# Altium schematic sheet Light Board.SchDoc
size A4
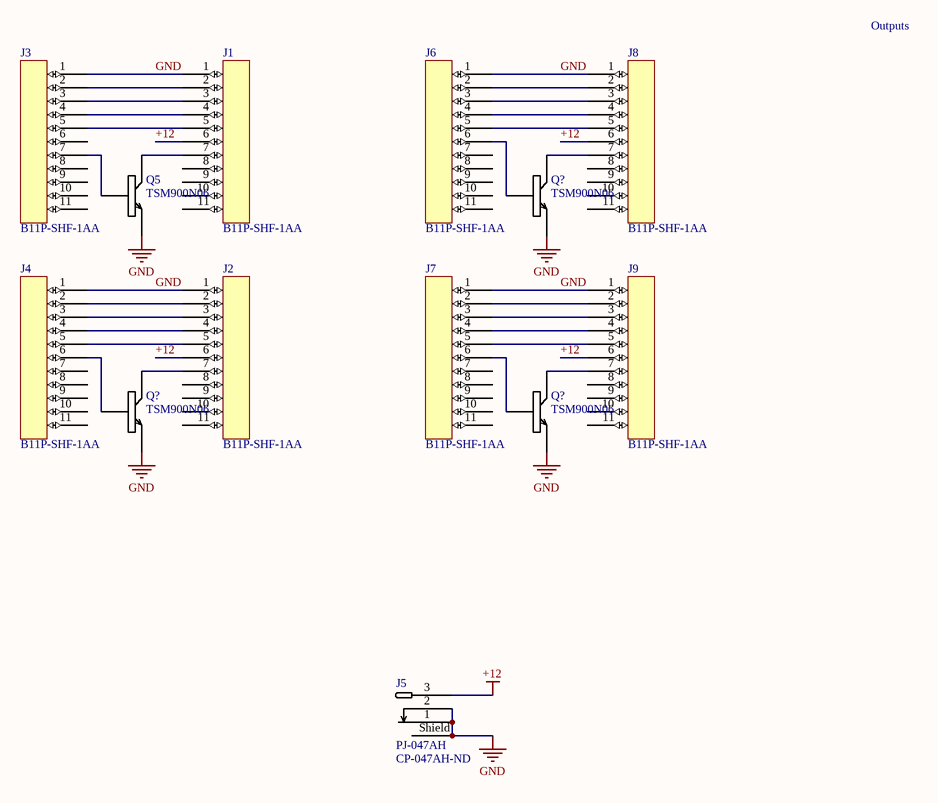
[diagram p0: Light Board.SchDoc]

## Parts
(Parts that share a designator on the sheet are numbered #1, #2 ... from top to bottom, then left to right.)
J1  B11P-SHF-1AA  [B11P-SHF-1AA]
J2  B11P-SHF-1AA  [B11P-SHF-1AA]
J3  B11P-SHF-1AA  [B11P-SHF-1AA]
J4  B11P-SHF-1AA  [B11P-SHF-1AA]
J5  PJ-047AH  Supplier Part Number 1: CP-047AH-ND  [PJ-047AH]
J6  B11P-SHF-1AA  [B11P-SHF-1AA]
J7  B11P-SHF-1AA  [B11P-SHF-1AA]
J8  B11P-SHF-1AA  [B11P-SHF-1AA]
J9  B11P-SHF-1AA  [B11P-SHF-1AA]
Q5  TSM900N06  [TO-252]
Q?#1  TSM900N06  [TO-252]
Q?#2  TSM900N06  [TO-252]
Q?#3  TSM900N06  [TO-252]

## Nets
+12: J1.6 J2.6 J5.3 J8.6 J9.6
GND: J1.1 J2.1 J3.1 J4.1 J5.1 J5.2 J5.Shield J6.1 J7.1 J8.1 J9.1 Q5.2(Drain) Q?#1.2(Drain) Q?#2.2(Drain) Q?#3.2(Drain)
NetJ1_2: J1.2 J3.2
NetJ1_3: J1.3 J3.3
NetJ1_4: J1.4 J3.4
NetJ1_5: J1.5 J3.5
NetJ1_7: J1.7 Q5.3(Source)
NetJ2_2: J2.2 J4.2
NetJ2_3: J2.3 J4.3
NetJ2_4: J2.4 J4.4
NetJ2_5: J2.5 J4.5
NetJ2_7: J2.7 Q?#2.3(Source)
NetJ3_7: J3.7 Q5.1(Gate)
NetJ4_6: J4.6 Q?#2.1(Gate)
NetJ6_2: J6.2 J8.2
NetJ6_3: J6.3 J8.3
NetJ6_4: J6.4 J8.4
NetJ6_5: J6.5 J8.5
NetJ6_6: J6.6 Q?#1.1(Gate)
NetJ7_2: J7.2 J9.2
NetJ7_3: J7.3 J9.3
NetJ7_4: J7.4 J9.4
NetJ7_5: J7.5 J9.5
NetJ7_6: J7.6 Q?#3.1(Gate)
NetJ8_7: J8.7 Q?#1.3(Source)
NetJ9_7: J9.7 Q?#3.3(Source)

Not connected (* = marked no-connect by the designer): J1 8 9 10 11; J2 8 9 10 11; J3 6 8 9 10 11; J4 7 8 9 10 11; J6 7 8 9 10 11; J7 7 8 9 10 11; J8 8 9 10 11; J9 8 9 10 11

## Notes on the sheet
- Outputs

## Library data of the parts
J1-J4 J6-J9 = B11P-SHF-1AA: Manufacturer: JST; Manufacturer Part Number: B11P-SHF-1AA(LF)(SN); Current Rating: 3A; Voltage Rating: 250V; Number of Positions: 11; Connector Type: Male Pin; Pitch: 0.098inch; Supplier 1: Digi-Key; Stock 1: 0; Pricing 1: 250=0.48872 (USD); Mount: Through Hole; Contact Plating: Tin; Contact Material: Brass; Color: Natural; Number of Rows: 1; Packaging: Bulk; Termination: Solder; Fastening Type: Friction; Number of Contacts: 11; Orientation: Straight; Contact Mating Length: 0.236inch; ComponentLink1URL: http://www.jst-mfg.com/product/pdf/eng/eNH.pdf?src-supplier=Digi-Key; ComponentLink1Description: http://www.jst-mfg.com/product/pdf/eng/eNH.pdf?src-supplier=Digi-Key; Supplier Part Number 1: B11P-SHF-1AA(LF)(SN)-ND
J5 = PJ-047AH: Manufacturer: CUI; Gender: Male; Shielding: Shielded; Current Rating: 5A; Connector Type: Jack; Voltage Rating: 24V; Insulation Resistance: 100MR; Number of Conductors: 2; Supplier 1: Digi-Key; Manufacturer Part Number: PJ-047AH; Stock 1: 6714; Pricing 1: 1=0.8, 10=0.701, 25=0.66, 50=0.6326, 100=0.605, 250=0.55, 500=0.495, 1000=0.44, 2500=0.39875 (USD); Mount: Through Hole; Color: Black; Contact Material: Brass,Copper; Contact Plating: Nickel; Housing Color: Black; Housing Material: Thermoplastic; Min Operating Temperature: -25°C; Max Operating Temperature: 85°C; Package Quantity: 500; Termination: Solder; Contact Gender: Male; Orientation: Horizontal; Flammability Rating: UL94 V-0; Lead Free: Lead Free
Q5 Q?#1-Q?#3 = TSM900N06: Manufacturer: Taiwan Semiconductor; Manufacturer Part Number: TSM900N06CPROG; Supplier 1: Arrow Electronics Inc.; Stock 1: 2500; Pricing 1: 1=0.5174, 10=0.4387, 25=0.4341, 50=0.4294, 100=0.3242, 250=0.3207, 500=0.236, 1000=0.182, 3000=0.1809, 6000=0.179, 15000=0.177, 30000=0.175, 75000=0.1729 (USD); Supplier Part Number 1: TSM900N06CP ROG